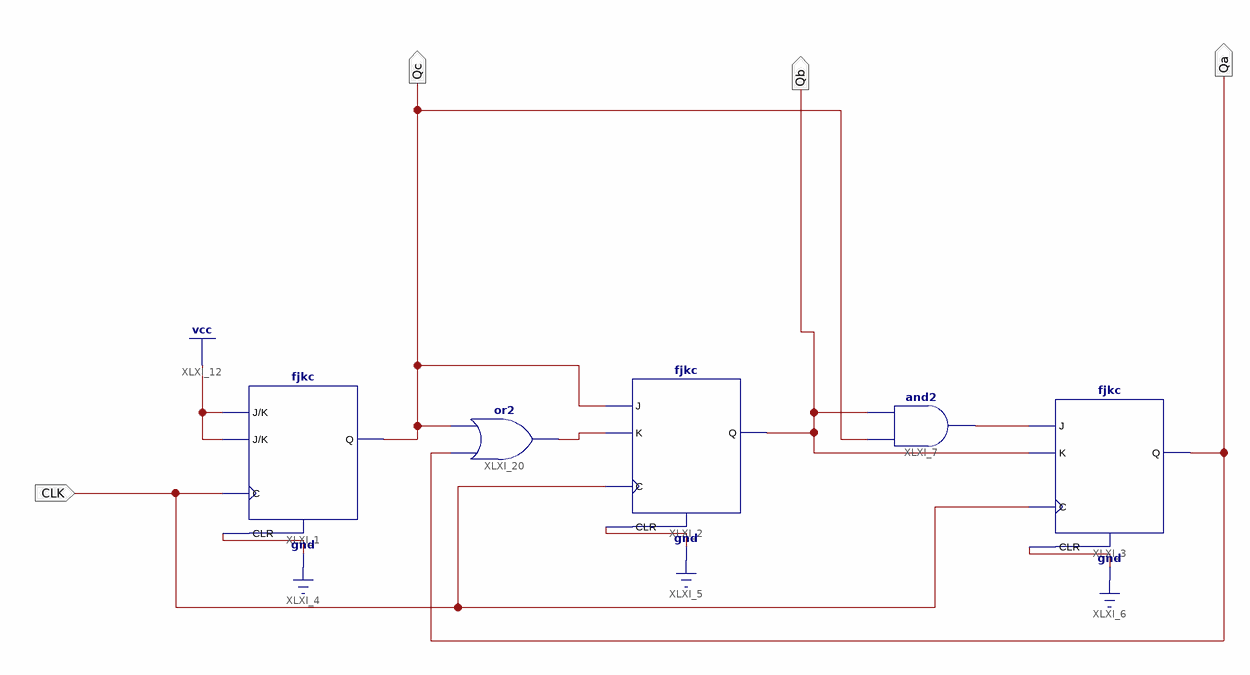
[diagram p0: schematic sheet 1]
// Xilinx ISE schematic Lab05_2Schematic.sch (spartan6) as structural Verilog: 5 symbols, 4 ports
module Lab05_2Schematic (
  input  CLK,
  output Qb,
  output Qc,
  output Qa
);

  wire XLXN_29, XLXN_42;

  fjkc XLXI_1 (.C(CLK), .CLR(1'b0), .J(1'b1), .K(1'b1), .Q(Qc));
  and XLXI_7 (XLXN_29, Qc, Qb);
  fjkc XLXI_3 (.C(CLK), .CLR(1'b0), .J(XLXN_29), .K(Qb), .Q(Qa));
  fjkc XLXI_2 (.C(CLK), .CLR(1'b0), .J(Qc), .K(XLXN_42), .Q(Qb));
  or XLXI_20 (XLXN_42, Qa, Qc);
endmodule
